# Altium project water_treatment_controller.PrjPcb
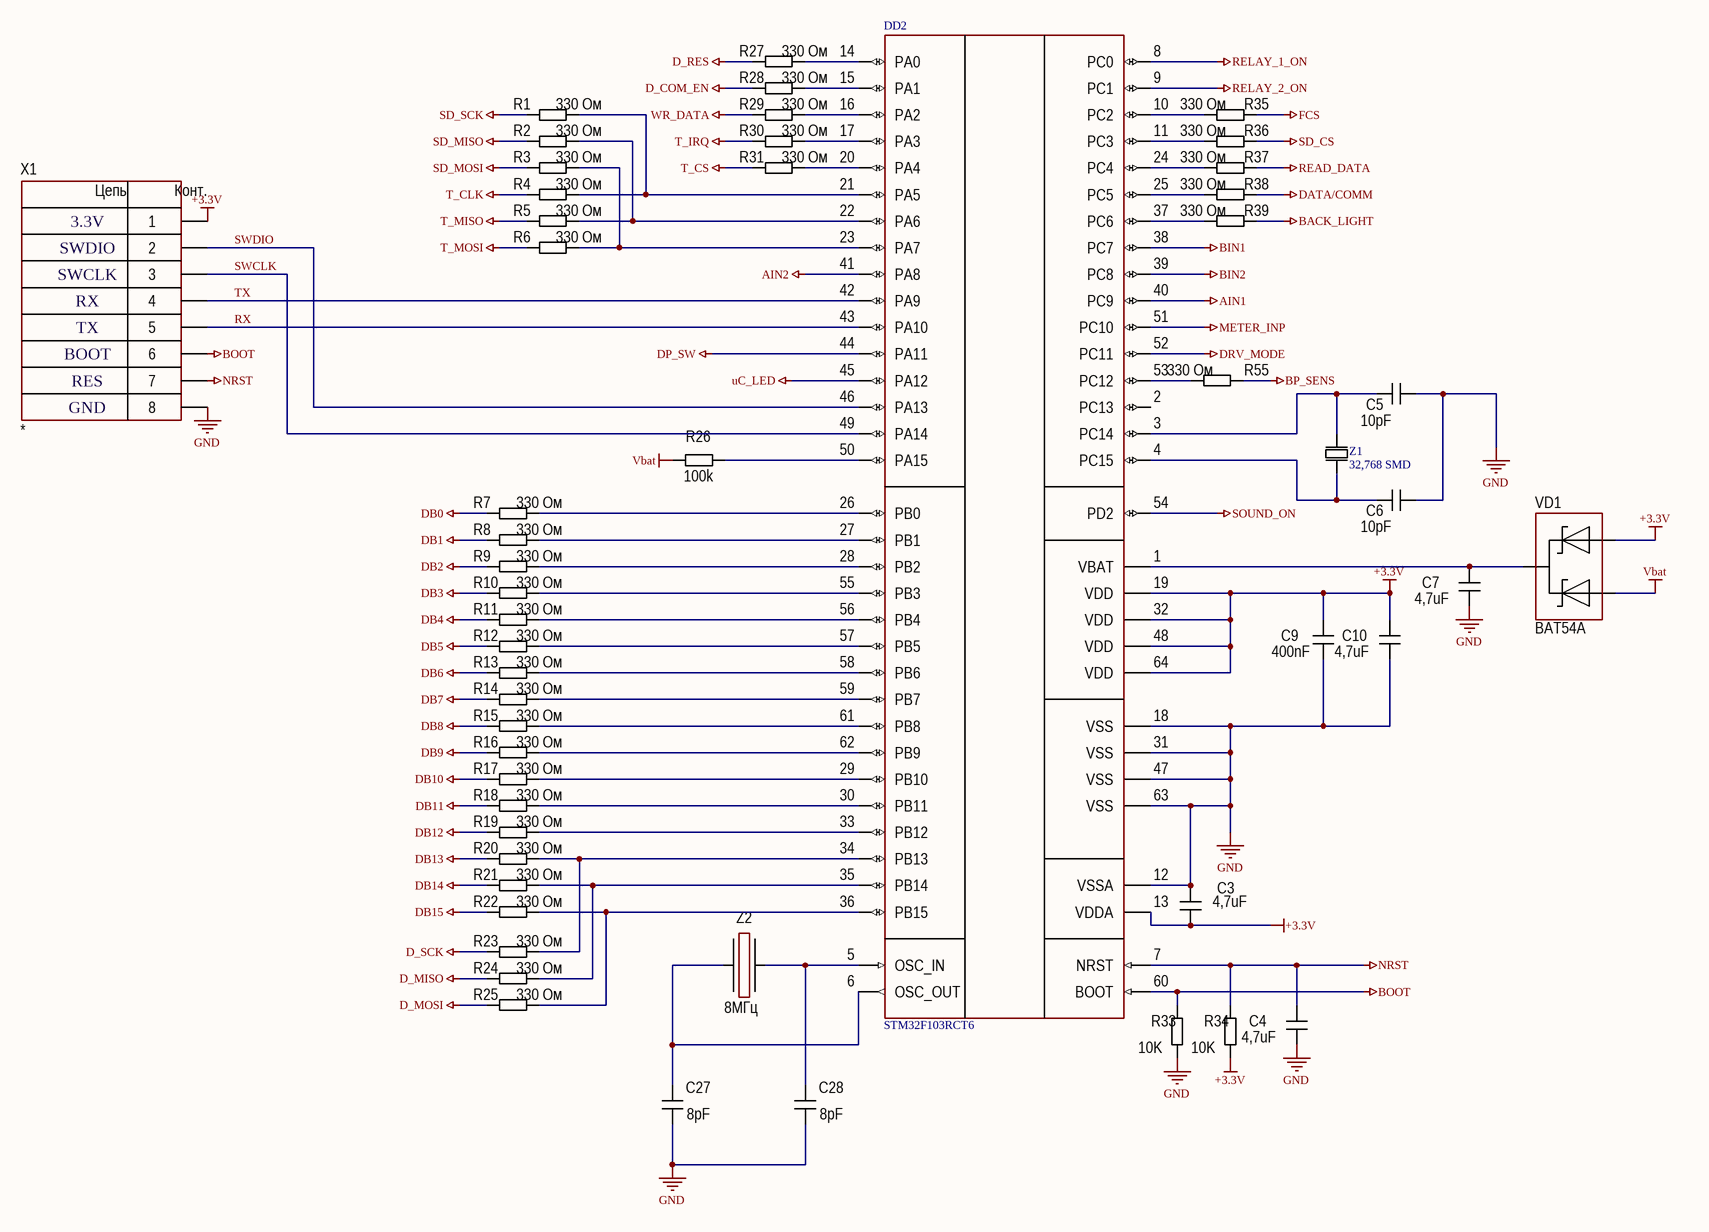
[diagram p0: 1_uC.SchDoc]
4 sheets, 141 parts. Net scope: global (net labels, ports and power ports of the same name join across sheets).
Board file: wtc.PcbDoc
Sheets:
  1_uC.SchDoc
  2_PowerPerif.SchDoc
  3_InfoPerif.SchDoc
  4_PowerSupplie.SchDoc

## Sheet 1_uC.SchDoc
size 414 x 293 mm; SheetNumber: 1; SheetTotal: 4

### Parts
C3  4,7uF  [CH0402C]
C4  4,7uF  [CH0402C]
C5  10pF  [CH0402C]
C6  10pF  [CH0402C]
C7  4,7uF  [CH0402C]
C9  400nF  [CH0402C]
C10  4,7uF  [CH0402C]
C27  8pF  [CH0402C]
C28  8pF  [CH0402C]
DD2  STM32F103RCT6  [64-LQFP]
R1  330 Ом  [CH0603R]
R2  330 Ом  [CH0603R]
R3  330 Ом  [CH0603R]
R4  330 Ом  [CH0603R]
R5  330 Ом  [CH0603R]
R6  330 Ом  [CH0603R]
R7  330 Ом  [CH0603R]
R8  330 Ом  [CH0603R]
R9  330 Ом  [CH0603R]
R10  330 Ом  [CH0603R]
R11  330 Ом  [CH0603R]
R12  330 Ом  [CH0603R]
R13  330 Ом  [CH0603R]
R14  330 Ом  [CH0603R]
R15  330 Ом  [CH0603R]
R16  330 Ом  [CH0603R]
R17  330 Ом  [CH0603R]
R18  330 Ом  [CH0603R]
R19  330 Ом  [CH0603R]
R20  330 Ом  [CH0603R]
R21  330 Ом  [CH0603R]
R22  330 Ом  [CH0603R]
R23  330 Ом  [CH0603R]
R24  330 Ом  [CH0603R]
R25  330 Ом  [CH0603R]
R26  100k  [CH0603R]
R27  330 Ом  [CH0603R]
R28  330 Ом  [CH0603R]
R29  330 Ом  [CH0603R]
R30  330 Ом  [CH0603R]
R31  330 Ом  [CH0603R]
R33  10K  [CH0805R]
R34  10K  [CH0805R]
R35  330 Ом  [CH0603R]
R36  330 Ом  [CH0603R]
R37  330 Ом  [CH0603R]
R38  330 Ом  [CH0603R]
R39  330 Ом  [CH0603R]
R55  330 Ом  [CH0603R]
VD1  BAT54A  [SOT23_123]
X1  *  [CON: PLS-8]
Z1  32,768 SMD  [SMD 32.768KHz]
Z2  8МГц  [OSC: ABM3]

### Nets
+3.3V: C3.1 C9.1 C10.2 DD2.13(VDDA) DD2.19(VDD) DD2.32(VDD) DD2.48(VDD) DD2.64(VDD) R34.1 VD1.1 X1.1
AIN1: DD2.40(PC9)
AIN2: DD2.41(PA8)
BACK_LIGHT: R39.1
BIN1: DD2.38(PC7)
BIN2: DD2.39(PC8)
BOOT: DD2.60(BOOT) R33.2 X1.6
BP_SENS: R55.1
D_COM_EN: R28.1
D_MISO: R24.1
D_MOSI: R25.1
D_RES: R27.1
D_SCK: R23.1
DATA/COMM: R38.1
DB0: R7.1
DB1: R8.1
DB2: R9.1
DB3: R10.1
DB4: R11.1
DB5: R12.1
DB6: R13.1
DB7: R14.1
DB8: R15.1
DB9: R16.1
DB10: R17.1
DB11: R18.1
DB12: R19.1
DB13: R20.1
DB14: R21.1
DB15: R22.1
DP_SW: DD2.44(PA11)
DRV_MODE: DD2.52(PC11)
FCS: R35.1
GND: C3.2 C4.1 C5.2 C6.1 C7.1 C9.2 C10.1 C27.1 C28.1 DD2.12(VSSA) DD2.18(VSS) DD2.31(VSS) DD2.47(VSS) DD2.63(VSS) R33.1 X1.8
METER_INP: DD2.51(PC10)
NRST: C4.2 DD2.7(NRST) R34.2 X1.7
READ_DATA: R37.1
RELAY_1_ON: DD2.8(PC0)
RELAY_2_ON: DD2.9(PC1)
RX: DD2.43(PA10) X1.5
SD_CS: R36.1
SD_MISO: R2.1
SD_MOSI: R3.1
SD_SCK: R1.1
SOUND_ON: DD2.54(PD2)
T_CLK: R4.1
T_CS: R31.1
T_IRQ: R30.1
T_MISO: R5.1
T_MOSI: R6.1
TX: DD2.42(PA9) X1.4
uC_LED: DD2.45(PA12)
Vbat: R26.1 VD1.3
WR_DATA: R29.1
SWCLK: DD2.49(PA14) X1.3
SWDIO: DD2.46(PA13) X1.2
NetC5_1: C5.1 DD2.3(PC14) Z1.1
NetC6_2: C6.2 DD2.4(PC15) Z1.2
NetC7_2: C7.2 DD2.1(VBAT) VD1.2
NetC27_2: C27.2 DD2.6(OSC_OUT) Z2.1
NetC28_2: C28.2 DD2.5(OSC_IN) Z2.3
NetDD2_10: DD2.10(PC2) R35.2
NetDD2_11: DD2.11(PC3) R36.2
NetDD2_14: DD2.14(PA0) R27.2
NetDD2_15: DD2.15(PA1) R28.2
NetDD2_16: DD2.16(PA2) R29.2
NetDD2_17: DD2.17(PA3) R30.2
NetDD2_20: DD2.20(PA4) R31.2
NetDD2_21: DD2.21(PA5) R1.2 R4.2
NetDD2_22: DD2.22(PA6) R2.2 R5.2
NetDD2_23: DD2.23(PA7) R3.2 R6.2
NetDD2_24: DD2.24(PC4) R37.2
NetDD2_25: DD2.25(PC5) R38.2
NetDD2_26: DD2.26(PB0) R7.2
NetDD2_27: DD2.27(PB1) R8.2
NetDD2_28: DD2.28(PB2) R9.2
NetDD2_29: DD2.29(PB10) R17.2
NetDD2_30: DD2.30(PB11) R18.2
NetDD2_33: DD2.33(PB12) R19.2
NetDD2_34: DD2.34(PB13) R20.2 R23.2
NetDD2_35: DD2.35(PB14) R21.2 R24.2
NetDD2_36: DD2.36(PB15) R22.2 R25.2
NetDD2_37: DD2.37(PC6) R39.2
NetDD2_50: DD2.50(PA15) R26.2
NetDD2_53: DD2.53(PC12) R55.2
NetDD2_55: DD2.55(PB3) R10.2
NetDD2_56: DD2.56(PB4) R11.2
NetDD2_57: DD2.57(PB5) R12.2
NetDD2_58: DD2.58(PB6) R13.2
NetDD2_59: DD2.59(PB7) R14.2
NetDD2_61: DD2.61(PB8) R15.2
NetDD2_62: DD2.62(PB9) R16.2

Not connected (* = marked no-connect by the designer): DD2 2(PC13)

### Notes on the sheet
- 3.3V
- SWDIO
- SWCLK
- RX
- TX
- BOOT
- RES
- GND
- Изм.
- Лист
- № докум.
- Подпись
- Дата
- Лит.
- Масса
- Масштаб
- Пров.
- Разраб.
- Т. контр.
- Н. контр.
- Листов
- Утв.
- (in symbol 8-Connector) Цепь; Конт.

### Library data of the parts
C3-C6 C9 C10 C27 C28 = Capacitor: 0402; Manufacturer: *; Model: *; HelpURL: *; ComponentKind: *; Value: *
C7 = Capacitor: Manufacturer: *; Model: *; HelpURL: *; ComponentKind: *; Value: *
DD2 = STM32F103RCT6: Cortex-M3 (64-LQFP)
R1-R31 R35-R39 R55 = Resistor: 0603; Manufacturer: *; Model: *; HelpURL: *; ComponentKind: *; Value: *
R33 R34 = Resistor: 0805; Manufacturer: *; Model: *; HelpURL: *; ComponentKind: *; Value: *
VD1 = Diod Schottky Array v.1: SOT-23; ComponentKind: *; Manufacturer: *; Model: *; HelpURL: *
X1 = 8-Connector: Pin header 8; Model: *; Manufacturer: *; HelpURL: *; ComponentKind: *
Z1 = Kvarc_32,768: 32,768 kHz SMD 8mm x 3.8mm 12,5pF
Z2 = Oscillator: NX5032GA-8MHz; Manufacturer: *; Model: *; HelpURL: *; ComponentKind: *; Value: *

## Sheet 2_PowerPerif.SchDoc
size 414 x 293 mm; SheetNumber: 2; SheetTotal: 4
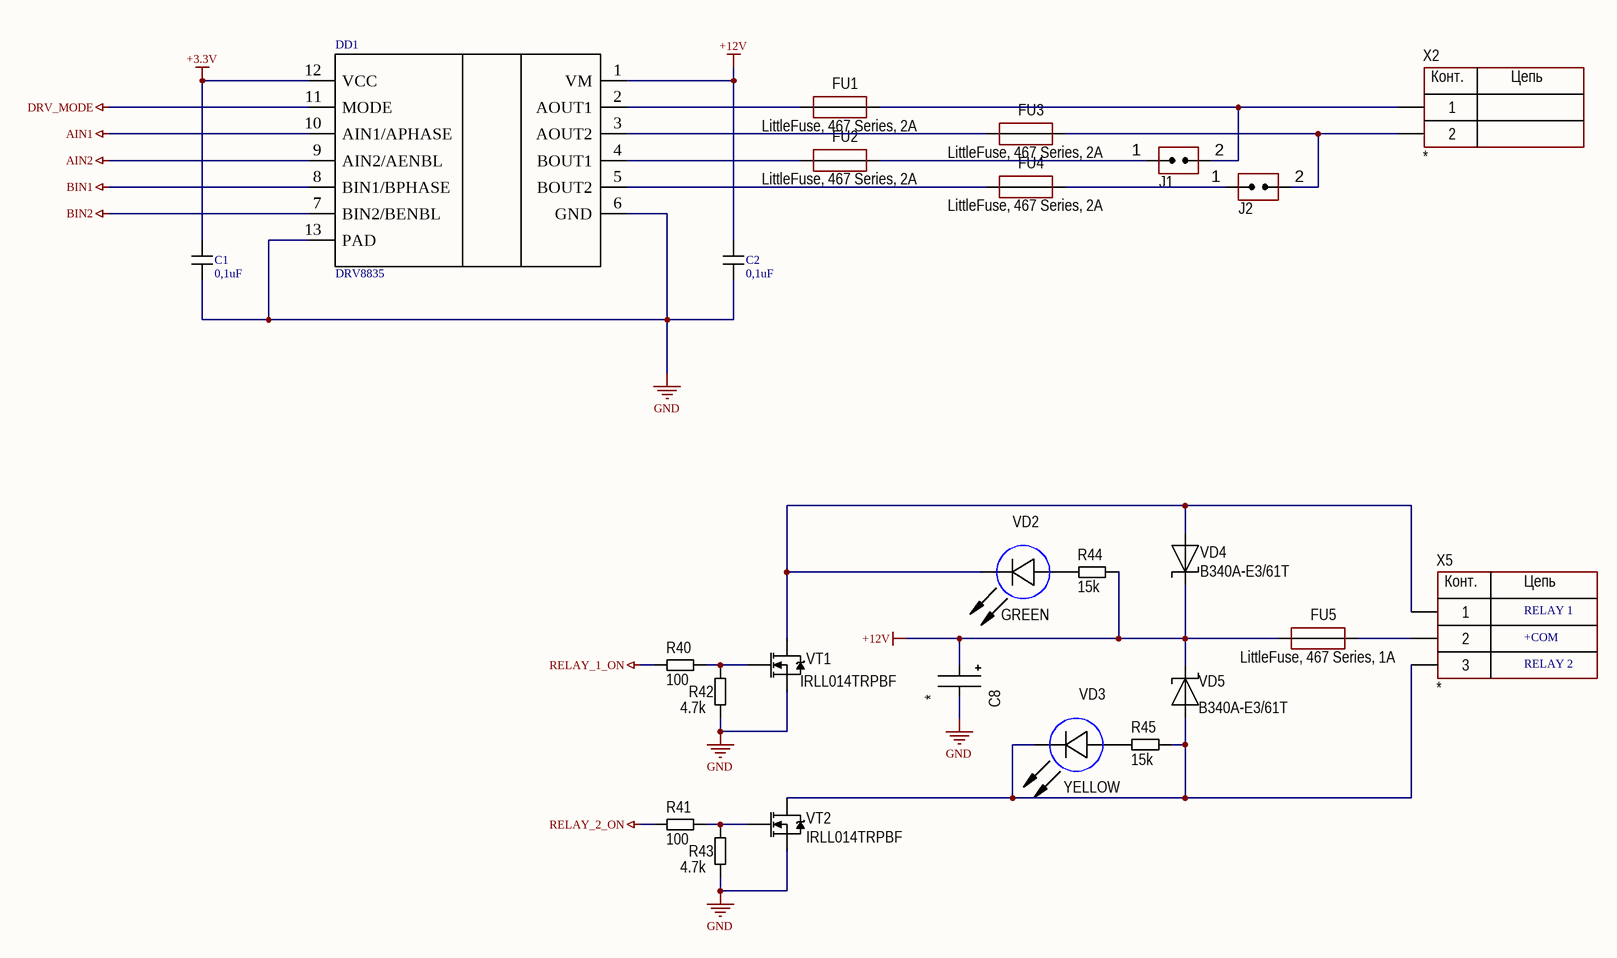
[diagram p1: 2_PowerPerif.SchDoc]

### Parts
C1  0,1uF  [C_0603]
C2  0,1uF  [C_0603]
C8  *  [D8C3.2H12]
DD1  DRV8835  [WSON12]
FU1  LittleFuse, 467 Series, 2A  [CH0603F]
FU2  LittleFuse, 467 Series, 2A  [CH0603F]
FU3  LittleFuse, 467 Series, 2A  [CH0603F]
FU4  LittleFuse, 467 Series, 2A  [CH0603F]
FU5  LittleFuse, 467 Series, 1A  [CH0603F]
J1  Jumper-2  [CON: PLS-2]  (value not drawn)
J2  Jumper-2  [CON: PLS-2]  (value not drawn)
R40  100  [CH0805R]
R41  100  [CH0805R]
R42  4.7k  [CH0805R]
R43  4.7k  [CH0805R]
R44  15k  [CH0805R]
R45  15k  [CH0805R]
VD2  GREEN  [CH0603LB]
VD3  YELLOW  [CH0603LB]
VD4  B340A-E3/61T  [SMA]
VD5  B340A-E3/61T  [SMA]
VT1  IRLL014TRPBF  [SOT223]
VT2  IRLL014TRPBF  [SOT223]
X2  *  [CON: CWF-2]
X5  *  [CON: 300-03P-5.0]

### Nets
+3.3V: C1.2 DD1.12(VCC)
+12V: C2.2 C8.1 DD1.1(VM) FU5.1 R44.2 VD4.2 VD5.2
AIN1: DD1.10(AIN1/APHASE)
AIN2: DD1.9(AIN2/AENBL)
BIN1: DD1.8(BIN1/BPHASE)
BIN2: DD1.7(BIN2/BENBL)
DRV_MODE: DD1.11(MODE)
GND: C1.1 C2.1 C8.2 DD1.6(GND) DD1.13(PAD) R42.1 R43.1 VT1.3(S) VT2.3(S)
RELAY_1_ON: R40.2
RELAY_2_ON: R41.2
NetDD1_2: DD1.2(AOUT1) FU1.1
NetDD1_3: DD1.3(AOUT2) FU3.1
NetDD1_4: DD1.4(BOUT1) FU2.1
NetDD1_5: DD1.5(BOUT2) FU4.1
NetFU1_2: FU1.2 J1.2(IN) X2.1
NetFU2_2: FU2.2 J1.1(IN)
NetFU3_2: FU3.2 J2.2(IN) X2.2
NetFU4_2: FU4.2 J2.1(IN)
NetFU5_2: FU5.2 X5.2
NetR40_1: R40.1 R42.2 VT1.1(G)
NetR41_1: R41.1 R43.2 VT2.1(G)
NetR44_1: R44.1 VD2.1(A)
NetR45_1: R45.1 VD3.1(A)
NetR45_2: R45.2 VD3.2(C) VD5.1 VT2.2(D) X5.3
NetVD2_2: VD2.2(C) VD4.1 VT1.2(D) X5.1

### Notes on the sheet
- RELAY 1
- +COM
- RELAY 2
- Лист
- Изм.
- № докум.
- Подпись
- Дата
- (in symbol 2-Connector) Конт.; Цепь
- (in symbol 3-Connector) Конт.; Цепь

### Library data of the parts
C1 C2 = C_SMD
C8 = AlumCap: Manufacturer: *; Model: *; HelpURL: *; ComponentKind: *; Value: *
DD1 = DRV8835: Driver
FU1-FU5 = Fuse: Manufacturer: *; Model: *; HelpURL: *; ComponentKind: *; Value: *
J1 J2 = Jumper-2: Jumper; Manufacturer: China; Model: PLS-2
R40-R45 = Resistor: Manufacturer: *; Model: *; HelpURL: *; ComponentKind: *; Value: *
VD2 VD3 = LED_1: Manufacturer: *; Model: *; HelpURL: *; ComponentKind: *; Value: *
VD4 VD5 = Diod Schottky: ComponentKind: *; Manufacturer: *; Model: *; HelpURL: *
VT1 VT2 = N-chanel: Mosfet; Model: *; Manufacturer: *; ComponentKind: *; HelpURL: *
X2 = 2-Connector: Model: *; Manufacturer: *; HelpURL: *; ComponentKind: *
X5 = 3-Connector: Model: *; Manufacturer: *; HelpURL: *; ComponentKind: *

## Sheet 3_InfoPerif.SchDoc
size 414 x 293 mm; SheetNumber: 3; SheetTotal: 4
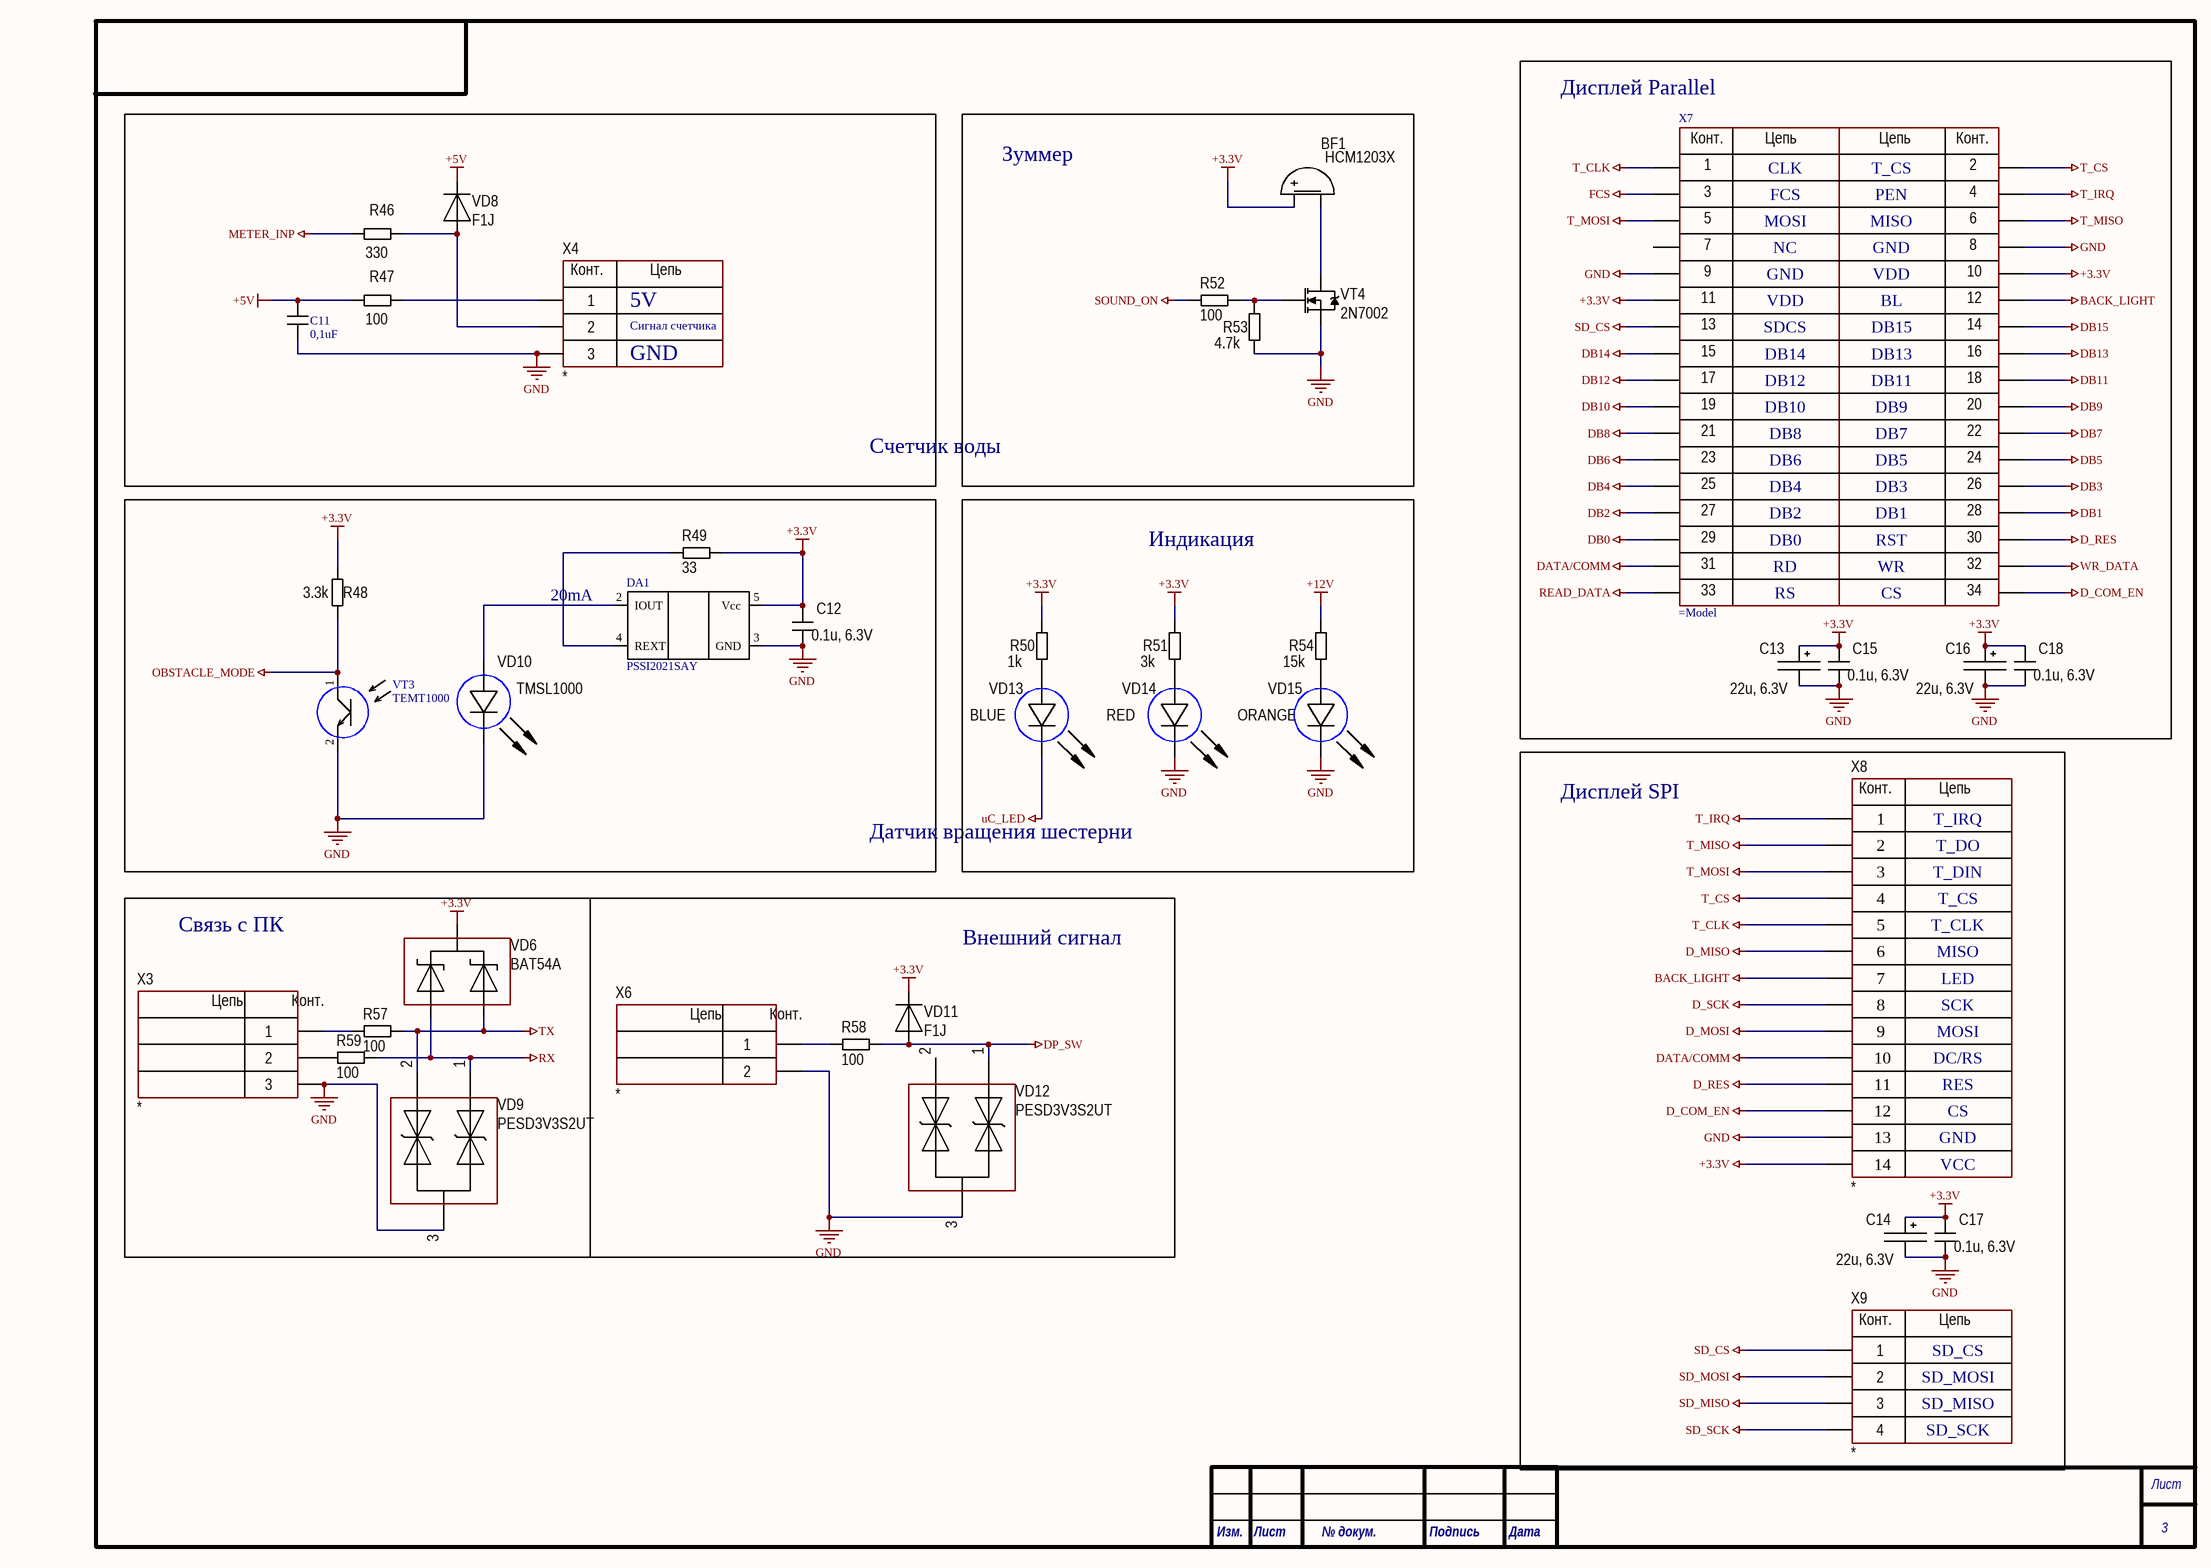
[diagram p2: 3_InfoPerif.SchDoc]

### Parts
BF1  HCM1203X  [BUZ: AI-1223-TWT-3V-2-R]
C11  0,1uF  [C_0603]
C12  0.1u, 6.3V  [CH0805C]
C13  22u, 6.3V  [TANTAL_B]
C14  22u, 6.3V  [TANTAL_B]
C15  0.1u, 6.3V  [CH0805C]
C16  22u, 6.3V  [TANTAL_B]
C17  0.1u, 6.3V  [CH0805C]
C18  0.1u, 6.3V  [CH0805C]
DA1  PSSI2021SAY  [SOT353]
R46  330  [CH0805R]
R47  100  [CH2512R]
R48  3.3k  [CH0805R]
R49  33  [CH0805R]
R50  1k  [CH0805R]
R51  3k  [CH0805R]
R52  100  [CH0805R]
R53  4.7k  [CH0805R]
R54  15k  [CH0805R]
R57  100  [CH0805R]
R58  100  [CH0805R]
R59  100  [CH0805R]
VD6  BAT54A  [SOT23_123]
VD8  F1J  [SOD123F]
VD9  PESD3V3S2UT  [SOT23_132]
VD10  TMSL1000  [TSML1000]
VD11  F1J  [SOD123F]
VD12  PESD3V3S2UT  [SOT23_132]
VD13  BLUE  [CH0603LB]
VD14  RED  [CH0603LB]
VD15  ORANGE  [CH0603LB]
VT3  TEMT1000  [TEMT1000]
VT4  2N7002  [SOT23_123]
X3  *  [CON: CWF-3]
X4  *  [CON: CWF-3]
X6  *  [CON: CWF-2]
X7  (no value)  [DS1023-34]
X8  *  [DS1024-14]
X9  *  [DS1023-4]

### Blocks framed on the sheet
Дисплей Parallel: C13 C15 C16 C18 X7
Зуммер: BF1 R52 R53 VT4
Датчик вращения шестерни: C12 DA1 R48 R49 VD10 VT3
Индикация: R50 R51 R54 VD13-VD15
Дисплей SPI: C14 C17 X8 X9
Связь с ПК: R57 R59 VD6 VD9 X3
Внешний сигнал: R58 VD11 VD12 X6

### Nets
+3.3V: BF1.1(+) C12.2 C13.1 C14.1 C15.2 C16.1 C17.2 C18.2 DA1.5(Vcc) R48.2 R49.2 R50.2 R51.2 VD6.2 VD11.2 X7.10 X7.11 X8.14
+5V: C11.2 R47.1 VD8.2
+12V: R54.2
BACK_LIGHT: X7.12 X8.7
D_COM_EN: X7.34 X8.12
D_MISO: X8.6
D_MOSI: X8.9
D_RES: X7.30 X8.11
D_SCK: X8.8
DATA/COMM: X7.31 X8.10
DB0: X7.29
DB1: X7.28
DB2: X7.27
DB3: X7.26
DB4: X7.25
DB5: X7.24
DB6: X7.23
DB7: X7.22
DB8: X7.21
DB9: X7.20
DB10: X7.19
DB11: X7.18
DB12: X7.17
DB13: X7.16
DB14: X7.15
DB15: X7.14
DP_SW: R58.2 VD11.1 VD12.1
FCS: X7.3
GND: C11.1 C12.1 C13.2 C14.2 C15.1 C16.2 C17.1 C18.1 DA1.3(GND) R53.1 VD9.3 VD10.2(C) VD12.3 VD14.2(C) VD15.2(C) VT3.2 VT4.3(S) X3.3 X4.3 X6.2 X7.8 X7.9 X8.13
METER_INP: R46.1
OBSTACLE_MODE: R48.1 VT3.1
READ_DATA: X7.33
RX: R59.2 VD6.3 VD9.1
SD_CS: X7.13 X9.1
SD_MISO: X9.3
SD_MOSI: X9.2
SD_SCK: X9.4
SOUND_ON: R52.2
T_CLK: X7.1 X8.5
T_CS: X7.2 X8.4
T_IRQ: X7.4 X8.1
T_MISO: X7.6 X8.2
T_MOSI: X7.5 X8.3
TX: R57.2 VD6.1 VD9.2
uC_LED: VD13.2(C)
WR_DATA: X7.32
NetBF1_2: BF1.2(-) VT4.2(D)
NetDA1_2: DA1.2(IOUT) VD10.1(A)
NetDA1_4: DA1.4(REXT) R49.1
NetR46_2: R46.2 VD8.1 X4.2
NetR47_2: R47.2 X4.1
NetR50_1: R50.1 VD13.1(A)
NetR51_1: R51.1 VD14.1(A)
NetR52_1: R52.1 R53.2 VT4.1(G)
NetR54_1: R54.1 VD15.1(A)
NetR57_1: R57.1 X3.1
NetR58_1: R58.1 X6.1
NetR59_1: R59.1 X3.2

Not connected (* = marked no-connect by the designer): VD12 2; X7 7

### Notes on the sheet
- (near X7) CLK
- (near X7) T_CS
- (near X7) FCS
- (near X7) MOSI
- (near X7) MISO
- (near X7) PEN
- 5V
- (near X7) NC
- (near X7) GND
- (near X7) VDD
- (near X7) BL
- GND
- Сигнал счетчика
- (near X7) SDCS
- (near X7) DB14
- (near X7) DB12
- (near X7) DB11
- (near X7) DB13
- (near X7) DB15
- (near X7) DB8
- (near X7) DB10
- (near X7) DB7
- (near X7) DB9
- Счетчик воды
- (near X7) DB2
- (near X7) DB4
- (near X7) DB6
- (near X7) DB1
- (near X7) DB3
- (near X7) DB5
- (near X7) DB0
- (near X7) RD
- (near X7) WR
- (near X7) RST
- 20mA
- (near X7) RS
- (near X7) CS
- T_IRQ
- T_DO
- T_DIN
- T_CS
- T_CLK
- MISO
- LED
- SCK
- MOSI
- DC/RS
- RES
- CS
- VCC
- SD_CS
- SD_MOSI
- SD_MISO
- SD_SCK
- Лист
- Изм.
- № докум.
- Подпись
- Дата
- (in symbol 2-Connector) Цепь; Конт.
- (in symbol 4-Connector) Конт.; Цепь
- (in symbol 14-Connector) Конт.; Цепь
- (in symbol 34-Connector) Конт.; Цепь

### Library data of the parts
BF1 = Buzzer: Manufacturer: PUI Audio, Inc.; Model: AI-1223-TWT-3V-2-R; HelpURL: https://www.digikey.com/product-detail/en/pui-audio-inc/AI-1223-TWT-3V-2-R/668-1456-ND/5011391; ComponentKind: Internally Driven
C11 = C_SMD
C12 = Capacitor: 0805; Manufacturer: *; Model: *; HelpURL: *; ComponentKind: *; Value: *
C13 C14 C16 = TantalCap: Manufacturer: *; Model: *; HelpURL: *; ComponentKind: *; Value: *
C15 C17 C18 = Capacitor: Manufacturer: *; Model: *; HelpURL: *; ComponentKind: *; Value: *
DA1 = PSSI2021SAY: Iout = 0.617/Rext + 15 µA
R46 R47 R50-R54 R57-R59 = Resistor: Manufacturer: *; Model: *; HelpURL: *; ComponentKind: *; Value: *
R48 R49 = Resistor: 0805; Manufacturer: *; Model: *; HelpURL: *; ComponentKind: *; Value: *
VD6 = Diod Schottky Array v.1: ComponentKind: *; Manufacturer: *; Model: *; HelpURL: *
VD8 VD11 = Diod: ComponentKind: *; Manufacturer: *; Model: *; HelpURL: *
VD9 VD12 = TVS Array: ComponentKind: *; Manufacturer: *; Model: *; HelpURL: *
VD10 VD13-VD15 = LED_1: Manufacturer: *; Model: *; HelpURL: *; ComponentKind: *; Value: *
VT4 = N-chanel: Mosfet; Model: *; Manufacturer: *; ComponentKind: *; HelpURL: *
X3 X4 = 3-Connector: Model: *; Manufacturer: *; HelpURL: *; ComponentKind: *
X6 = 2-Connector: Model: *; Manufacturer: *; HelpURL: *; ComponentKind: *
X7 = 34-Connector
X8 = 14-Connector: Model: *; Manufacturer: *; HelpURL: *; ComponentKind: *
X9 = 4-Connector: Model: *; Manufacturer: *; HelpURL: *; ComponentKind: *

## Sheet 4_PowerSupplie.SchDoc
size 414 x 293 mm; SheetNumber: 4; SheetTotal: 4; PageSetup: Record=PageOptionsZCenterHorizontal=TrueZCenterVertical=TrueZPrintScale=1.00ZXCorrection=0.00ZYCorrection=0.00ZPrintKind=1ZBorderSize=5000000ZLeftOffset=0ZBottomOffset=0ZOrientation=2ZPaperLength=1000ZPaperWidth=1000ZScale=100ZPaperSource=7ZPrintQuality=-4ZMediaType=1ZDitherType=10ZPaperKind=A3ZPrintScaleMode=0; Razrabotal: {Разработал}; Proveril: {Проверил}; Tkontr: {Т.контр.}; Nkontr: {Н.контр.}; Ytverdil: {Утвердил}; Nazvanie1: {Название1}; Nazvanie2: {Название2}; Oboznachenie: {Обозначение}
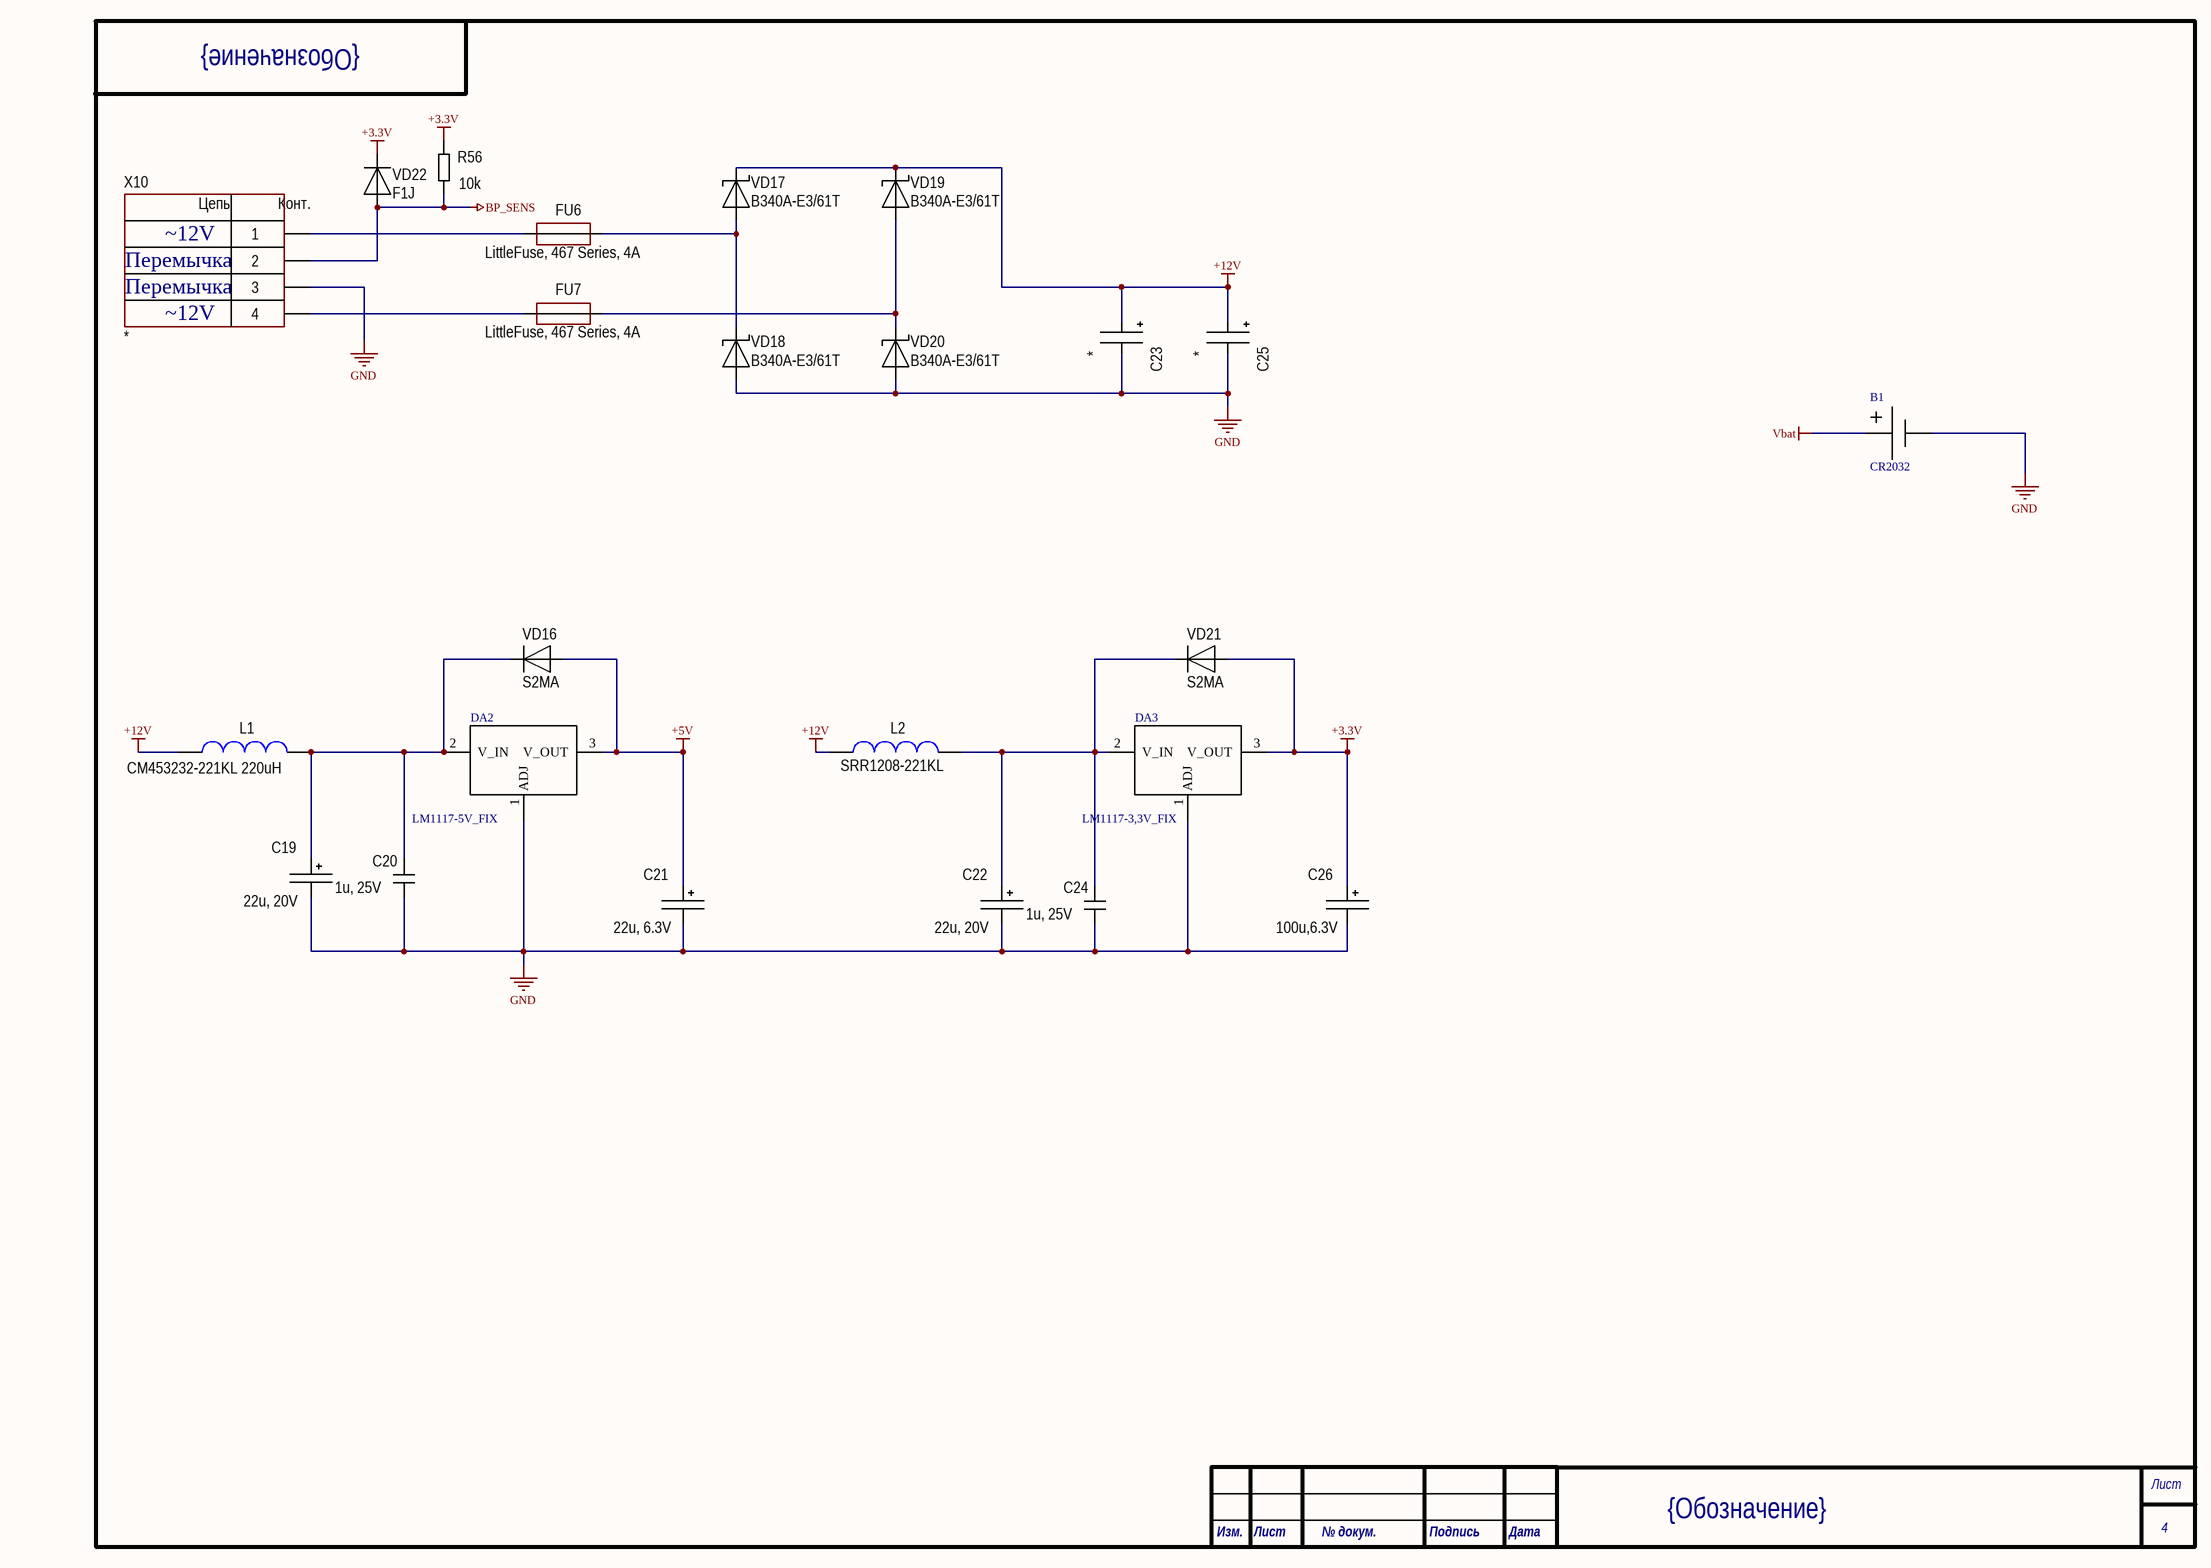
[diagram p3: 4_PowerSupplie.SchDoc]

### Parts
B1  CR2032  [CR2032]
C19  22u, 20V  [TANTAL_B]
C20  1u, 25V  [CH0805C]
C21  22u, 6.3V  [TANTAL_B]
C22  22u, 20V  [TANTAL_B]
C23  *  [D10C4.4H10]
C24  1u, 25V  [CH0805C]
C25  *  [D10C4.4H10]
C26  100u,6.3V  [TANTAL_B]
DA2  LM1117-5V_FIX  [SOT223_123]
DA3  LM1117-3,3V_FIX  [SOT223_123]
FU6  LittleFuse, 467 Series, 4A  [CH0603F]
FU7  LittleFuse, 467 Series, 4A  [CH0603F]
L1  CM453232-221KL 220uH  [IND:1812]
L2  SRR1208-221KL  [IND: SRR1208]
R56  10k  [CH0805R]
VD16  S2MA  [SMA]
VD17  B340A-E3/61T  [SMA]
VD18  B340A-E3/61T  [SMA]
VD19  B340A-E3/61T  [SMA]
VD20  B340A-E3/61T  [SMA]
VD21  S2MA  [SMA]
VD22  F1J  [SOD123F]
X10  *  [CON: CWF-4]

### Nets
+3.3V: C26.1 DA3.3(V_OUT) R56.2 VD21.1 VD22.2
+5V: C21.1 DA2.3(V_OUT) VD16.1
+12V: C23.1 C25.1 L1.2 L2.2 VD17.2 VD19.2
BP_SENS: R56.1 VD22.1 X10.2
GND: B1.2 C19.2 C20.1 C21.2 C22.2 C23.2 C24.1 C25.2 C26.2 DA2.1(ADJ) DA3.1(ADJ) VD18.1 VD20.1 X10.3
Vbat: B1.1
NetC19_1: C19.1 C20.2 DA2.2(V_IN) L1.1 VD16.2
NetC22_1: C22.1 C24.2 DA3.2(V_IN) L2.1 VD21.2
NetFU6_1: FU6.1 X10.1
NetFU6_2: FU6.2 VD17.1 VD18.2
NetFU7_1: FU7.1 X10.4
NetFU7_2: FU7.2 VD19.1 VD20.2

### Notes on the sheet
- Перемычка
- ~12V
- Лист
- Изм.
- № докум.
- Подпись
- Дата
- (in symbol 4-Connector) Цепь; Конт.

### Library data of the parts
B1 = Battery_CR2032
C19 C21 C22 C26 = TantalCap: Manufacturer: *; Model: *; HelpURL: *; ComponentKind: *; Value: *
C20 C24 = Capacitor: Manufacturer: *; Model: *; HelpURL: *; ComponentKind: *; Value: *
C23 C25 = AlumCap: Manufacturer: *; Model: *; HelpURL: *; ComponentKind: *; Value: *
DA2 DA3 = LM1117
FU6 FU7 = Fuse: Manufacturer: *; Model: *; HelpURL: *; ComponentKind: *; Value: *
L1 L2 = Inductor: Manufacturer: *; Model: *; HelpURL: *; ComponentKind: *; Value: *
R56 = Resistor: Manufacturer: *; Model: *; HelpURL: *; ComponentKind: *; Value: *
VD16 VD21 VD22 = Diod: ComponentKind: *; Manufacturer: *; Model: *; HelpURL: *
VD17-VD20 = Diod Schottky: ComponentKind: *; Manufacturer: *; Model: *; HelpURL: *
X10 = 4-Connector: Model: *; Manufacturer: *; HelpURL: *; ComponentKind: *

## Nets that join several sheets
+3.3V: 1_uC (11 pins), 2_PowerPerif (C1.2 DD1.12), 3_InfoPerif (18 pins), 4_PowerSupplie (5 pins)
+5V: 3_InfoPerif (C11.2 R47.1 VD8.2), 4_PowerSupplie (C21.1 DA2.3  VD16.1)
+12V: 2_PowerPerif (7 pins), 3_InfoPerif (R54.2), 4_PowerSupplie (6 pins)
AIN1: 1_uC (DD2.40), 2_PowerPerif (DD1.10)
AIN2: 1_uC (DD2.41), 2_PowerPerif (DD1.9)
BACK_LIGHT: 1_uC (R39.1), 3_InfoPerif (X7.12 X8.7)
BIN1: 1_uC (DD2.38), 2_PowerPerif (DD1.8)
BIN2: 1_uC (DD2.39), 2_PowerPerif (DD1.7)
BP_SENS: 1_uC (R55.1), 4_PowerSupplie (R56.1 VD22.1 X10.2)
D_COM_EN: 1_uC (R28.1), 3_InfoPerif (X7.34 X8.12)
D_MISO: 1_uC (R24.1), 3_InfoPerif (X8.6)
D_MOSI: 1_uC (R25.1), 3_InfoPerif (X8.9)
D_RES: 1_uC (R27.1), 3_InfoPerif (X7.30 X8.11)
D_SCK: 1_uC (R23.1), 3_InfoPerif (X8.8)
DATA/COMM: 1_uC (R38.1), 3_InfoPerif (X7.31 X8.10)
DB0: 1_uC (R7.1), 3_InfoPerif (X7.29)
DB1: 1_uC (R8.1), 3_InfoPerif (X7.28)
DB2: 1_uC (R9.1), 3_InfoPerif (X7.27)
DB3: 1_uC (R10.1), 3_InfoPerif (X7.26)
DB4: 1_uC (R11.1), 3_InfoPerif (X7.25)
DB5: 1_uC (R12.1), 3_InfoPerif (X7.24)
DB6: 1_uC (R13.1), 3_InfoPerif (X7.23)
DB7: 1_uC (R14.1), 3_InfoPerif (X7.22)
DB8: 1_uC (R15.1), 3_InfoPerif (X7.21)
DB9: 1_uC (R16.1), 3_InfoPerif (X7.20)
DB10: 1_uC (R17.1), 3_InfoPerif (X7.19)
DB11: 1_uC (R18.1), 3_InfoPerif (X7.18)
DB12: 1_uC (R19.1), 3_InfoPerif (X7.17)
DB13: 1_uC (R20.1), 3_InfoPerif (X7.16)
DB14: 1_uC (R21.1), 3_InfoPerif (X7.15)
DB15: 1_uC (R22.1), 3_InfoPerif (X7.14)
DP_SW: 1_uC (DD2.44), 3_InfoPerif (R58.2 VD11.1 VD12.1)
DRV_MODE: 1_uC (DD2.52), 2_PowerPerif (DD1.11)
FCS: 1_uC (R35.1), 3_InfoPerif (X7.3)
GND: 1_uC (16 pins), 2_PowerPerif (9 pins), 3_InfoPerif (23 pins), 4_PowerSupplie (14 pins)
METER_INP: 1_uC (DD2.51), 3_InfoPerif (R46.1)
READ_DATA: 1_uC (R37.1), 3_InfoPerif (X7.33)
RELAY_1_ON: 1_uC (DD2.8), 2_PowerPerif (R40.2)
RELAY_2_ON: 1_uC (DD2.9), 2_PowerPerif (R41.2)
RX: 1_uC (DD2.43 X1.5), 3_InfoPerif (R59.2 VD6.3 VD9.1)
SD_CS: 1_uC (R36.1), 3_InfoPerif (X7.13 X9.1)
SD_MISO: 1_uC (R2.1), 3_InfoPerif (X9.3)
SD_MOSI: 1_uC (R3.1), 3_InfoPerif (X9.2)
SD_SCK: 1_uC (R1.1), 3_InfoPerif (X9.4)
SOUND_ON: 1_uC (DD2.54), 3_InfoPerif (R52.2)
T_CLK: 1_uC (R4.1), 3_InfoPerif (X7.1 X8.5)
T_CS: 1_uC (R31.1), 3_InfoPerif (X7.2 X8.4)
T_IRQ: 1_uC (R30.1), 3_InfoPerif (X7.4 X8.1)
T_MISO: 1_uC (R5.1), 3_InfoPerif (X7.6 X8.2)
T_MOSI: 1_uC (R6.1), 3_InfoPerif (X7.5 X8.3)
TX: 1_uC (DD2.42 X1.4), 3_InfoPerif (R57.2 VD6.1 VD9.2)
uC_LED: 1_uC (DD2.45), 3_InfoPerif (VD13.2)
Vbat: 1_uC (R26.1 VD1.3), 4_PowerSupplie (B1.1)
WR_DATA: 1_uC (R29.1), 3_InfoPerif (X7.32)